# EAGLE schematic Headlightsv1 (EAGLE 7.6.0)
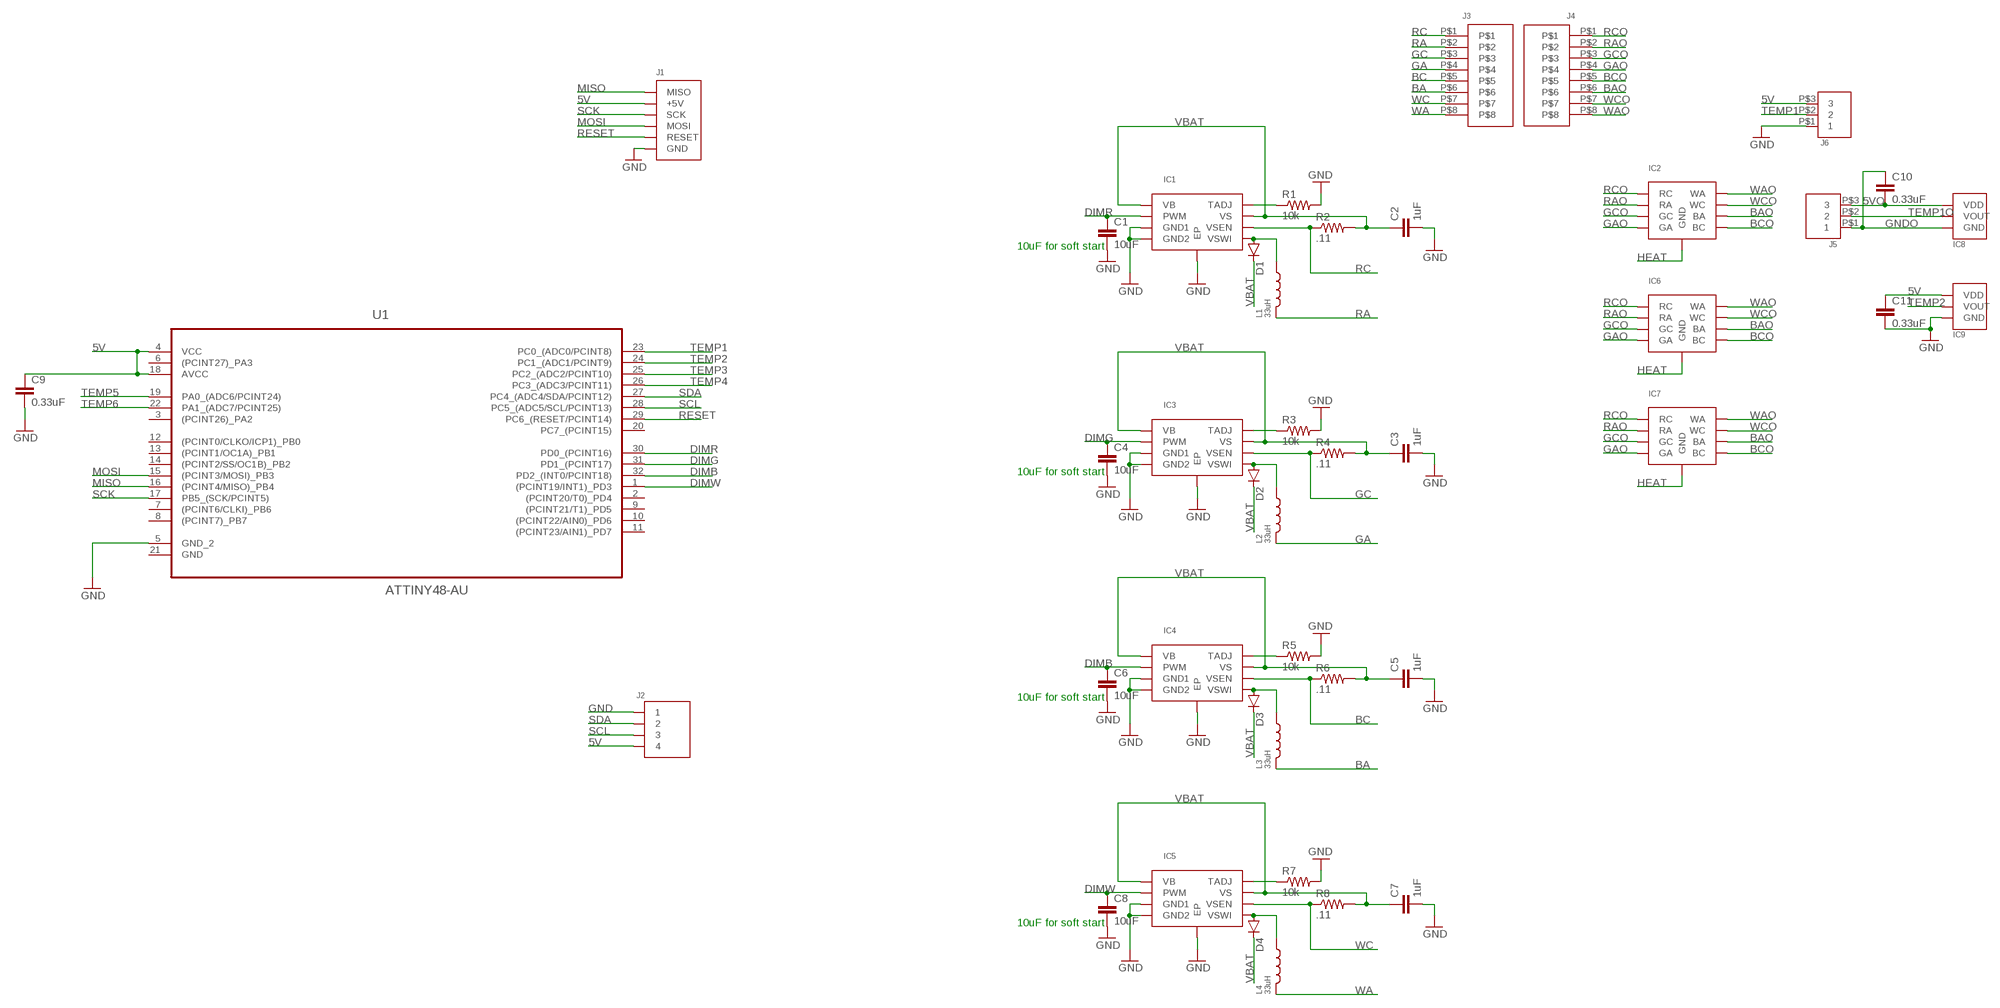
[diagram p0: schematic, sheet 1]

## Parts
C1  10uF  10UF10V10%(0805)  [0805-CAP]
C2  1uF  2.2UF50V10%(1206)  [1206-CAP]
C3  1uF  2.2UF50V10%(1206)  [1206-CAP]
C4  10uF  10UF10V10%(0805)  [0805-CAP]
C5  1uF  2.2UF50V10%(1206)  [1206-CAP]
C6  10uF  10UF10V10%(0805)  [0805-CAP]
C7  1uF  2.2UF50V10%(1206)  [1206-CAP]
C8  10uF  10UF10V10%(0805)  [0805-CAP]
C9  0.33uF  0.33UF-50V-10%(0805)  [0805-CAP]
C10  0.33uF  0.33UF-50V-10%(0805)  [0805-CAP]
C11  0.33uF  0.33UF-50V-10%(0805)  [0805-CAP]
D1  DIODESMA-ALT  [SMA-DIODE_ALT]
D2  DIODESMA-ALT  [SMA-DIODE_ALT]
D3  DIODESMA-ALT  [SMA-DIODE_ALT]
D4  DIODESMA-ALT  [SMA-DIODE_ALT]
IC1  ILD6150_LED_DRIVER  [PG-DSO-8-27]
IC2  LED_RGBW_CONF2  [LED_RGBW_CUSTOM]
IC3  ILD6150_LED_DRIVER  [PG-DSO-8-27]
IC4  ILD6150_LED_DRIVER  [PG-DSO-8-27]
IC5  ILD6150_LED_DRIVER  [PG-DSO-8-27]
IC6  LED_RGBW_CONF2  [LED_RGBW_CUSTOM]
IC7  LED_RGBW_CONF2  [LED_RGBW_CUSTOM]
IC8  TEMP_MCP9701  [SOT-23-3]
IC9  TEMP_MCP9701  [SOT-23-3]
J1  ISPHEADER  [2X3PIN_.1']
J2  CONNECTOR_4PIN  [4PIN_.1']
J3  CONNECTOR_8PIN  [8PIN_.1']
J4  CONNECTOR_8PIN  [8PIN_.1']
J5  CONNECTOR_3PIN  [3PIN_.1']
J6  CONNECTOR_3PIN  [3PIN_.1']
L1  33uH  CHIP_IND4  [IND_RLB_SERIES]
L2  33uH  CHIP_IND4  [IND_RLB_SERIES]
L3  33uH  CHIP_IND4  [IND_RLB_SERIES]
L4  33uH  CHIP_IND4  [IND_RLB_SERIES]
R1  10k  0.3OHM-1/8W-1%(0805)  [0805]
R2  .11  0.11OHM1/2W1%(2010)  [R2010]
R3  10k  0.3OHM-1/8W-1%(0805)  [0805]
R4  .11  0.11OHM1/2W1%(2010)  [R2010]
R5  10k  0.3OHM-1/8W-1%(0805)  [0805]
R6  .11  0.11OHM1/2W1%(2010)  [R2010]
R7  10k  0.3OHM-1/8W-1%(0805)  [0805]
R8  .11  0.11OHM1/2W1%(2010)  [R2010]
U1  ATTINY48-AU  [QFP80P900X900X120-32N]

## Nets
5V: C9.1 C11.1 IC9.1(VDD) J1.P$2(+5V) J2.P$4 J6.P$3 U1.4(VCC) U1.18(AVCC)
5VO: C10.2 IC8.1(VDD) J5.P$3
BA: J3.P$6 L3.P$1
BAO: IC2.6(BA) IC6.6(BA) IC7.6(BA) J4.P$6
BC: IC4.P$6(VSEN) J3.P$5 R6.1
BCO: IC2.5(BC) IC6.5(BC) IC7.5(BC) J4.P$5
DIMB: C6.1 IC4.P$2(PWM) U1.32(PD2_(INT0/PCINT18))
DIMG: C4.1 IC3.P$2(PWM) U1.31(PD1_(PCINT17))
DIMR: C1.1 IC1.P$2(PWM) U1.30(PD0_(PCINT16))
DIMW: C8.1 IC5.P$2(PWM) U1.1((PCINT19/INT1)_PD3)
GA: J3.P$4 L2.P$1
GAO: IC2.4(GA) IC6.4(GA) IC7.4(GA) J4.P$4
GC: IC3.P$6(VSEN) J3.P$3 R4.1
GCO: IC2.3(GC) IC6.3(GC) IC7.3(GC) J4.P$3
GND: C1.2 C2.2 C3.2 C4.2 C5.2 C6.2 C7.2 C8.2 C9.2 C11.2 IC1.P$3(GND1) IC1.P$4(GND2) IC1.P$9(EP) IC3.P$3(GND1) IC3.P$4(GND2) IC3.P$9(EP) IC4.P$3(GND1) IC4.P$4(GND2) IC4.P$9(EP) IC5.P$3(GND1) IC5.P$4(GND2) IC5.P$9(EP) IC9.3(GND) J1.P$6(GND) J2.P$1 J6.P$1 R1.2 R3.2 R5.2 R7.2 U1.5(GND_2)
GNDO: C10.1 IC8.3(GND) J5.P$1
HEAT: IC2.9(GND) IC6.9(GND) IC7.9(GND)
MISO: J1.P$1(MISO) U1.16((PCINT4/MISO)_PB4)
MOSI: J1.P$4(MOSI) U1.15((PCINT3/MOSI)_PB3)
N$1: IC1.P$8(TADJ) R1.1
N$2: IC3.P$8(TADJ) R3.1
N$3: D2.A IC3.P$5(VSWI) L2.P$2
N$4: IC4.P$8(TADJ) R5.1
N$5: D1.A IC1.P$5(VSWI) L1.P$2
N$6: D3.A IC4.P$5(VSWI) L3.P$2
N$7: IC5.P$8(TADJ) R7.1
N$8: D4.A IC5.P$5(VSWI) L4.P$2
RA: J3.P$2 L1.P$1
RAO: IC2.2(RA) IC6.2(RA) IC7.2(RA) J4.P$2
RC: IC1.P$6(VSEN) J3.P$1 R2.1
RCO: IC2.1(RC) IC6.1(RC) IC7.1(RC) J4.P$1
RESET: J1.P$5(RESET) U1.29(PC6_(RESET/PCINT14))
SCK: J1.P$3(SCK) U1.17(PB5_(SCK/PCINT5))
SCL: J2.P$3 U1.28(PC5_(ADC5/SCL/PCINT13))
SDA: J2.P$2 U1.27(PC4_(ADC4/SDA/PCINT12))
TEMP1: J6.P$2 U1.23(PC0_(ADC0/PCINT8))
TEMP1O: IC8.2(VOUT) J5.P$2
TEMP2: IC9.2(VOUT) U1.24(PC1_(ADC1/PCINT9))
TEMP3: U1.25(PC2_(ADC2/PCINT10))
TEMP4: U1.26(PC3_(ADC3/PCINT11))
TEMP5: U1.19(PA0_(ADC6/PCINT24))
TEMP6: U1.22(PA1_(ADC7/PCINT25))
VBAT: C2.1 C3.1 C5.1 C7.1 D1.C D2.C D3.C D4.C IC1.P$1(VB) IC1.P$7(VS) IC3.P$1(VB) IC3.P$7(VS) IC4.P$1(VB) IC4.P$7(VS) IC5.P$1(VB) IC5.P$7(VS) R2.2 R4.2 R6.2 R8.2
WA: J3.P$8 L4.P$1
WAO: IC2.8(WA) IC6.8(WA) IC7.8(WA) J4.P$8
WC: IC5.P$6(VSEN) J3.P$7 R8.1
WCO: IC2.7(WC) IC6.7(WC) IC7.7(WC) J4.P$7
Unconnected: U1.2((PCINT20/T0)_PD4) U1.3((PCINT26)_PA2) U1.6((PCINT27)_PA3) U1.7((PCINT6/CLKI)_PB6) U1.8((PCINT7)_PB7) U1.9((PCINT21/T1)_PD5) U1.10((PCINT22/AIN0)_PD6) U1.11((PCINT23/AIN1)_PD7) U1.12((PCINT0/CLKO/ICP1)_PB0) U1.13((PCINT1/OC1A)_PB1) U1.14((PCINT2/SS/OC1B)_PB2) U1.20(PC7_(PCINT15)) U1.21(GND)

## Notes on the sheet
- 10uF for soft start
- 10uF for soft start
- 10uF for soft start
- 10uF for soft start

## Library data of the parts
C1 C4 C6 C8 = SparkFun-Capacitors:10UF10V10%(0805): CAP-11330; PROD_ID: CAP-11330
C2 C3 C5 C7 = SparkFun-Capacitors:2.2UF50V10%(1206): CAP-10009
C9-C11 = SparkFun-Capacitors:0.33UF-50V-10%(0805): CAP-08469; PROD_ID: CAP-08469
D1-D4 = SparkFun-DiscreteSemi:DIODE: Diode These are standard reverse protection diodes and small signal diodes. SMA package can handle up to about 1A. SOD-323 can handle about 200mA. What the SOD-323 package when ordering, there are some mfgs out there that are 5-pin packages.
IC1 IC3-IC5 = lolomolo:ILD6150_LED_DRIVER
IC2 IC6 IC7 = lolomolo:LED_RGBW_CONF2
IC8 IC9 = lolomolo:TEMP_MCP9701
J1 = lolomolo:ISPHEADER
J2 = lolomolo:CONNECTOR_4PIN
J3 J4 = lolomolo:CONNECTOR_8PIN
J5 J6 = lolomolo:CONNECTOR_3PIN
L1-L4 = lolomolo:CHIP_IND: Chip Inductor
R1 R3 R5 R7 = SparkFun-Resistors:0.3OHM-1/8W-1%(0805): RES-11622; PROD_ID: RES-11622; VALUE: 0.3
R2 R4 R6 R8 = SparkFun-Resistors:0.11OHM1/2W1%(2010): RES-08354; PROD_ID: RES-08354
U1 = Atmel_By_element14_Batch_1-00:ATTINY48-AU: 8-bit Microcontroller; MPN: ATTINY48-AU; OC_FARNELL: 1636953; OC_NEWARK: 68T3768; PACKAGE: QFP-32; SUPPLIER: Atmel